# EasyEDA Pro project ProPrj_四轴3.0_2025-12-06.epro, schematic Schematic1
Board Name: main; Create Date: 2025-09-14; Page Name: P1; Project Name: 四轴3.0; Schematic Name: Schematic1; Update Date: 2025-09-14; Company: 嘉立创EDA; Page Size: A4; Version: V1.0
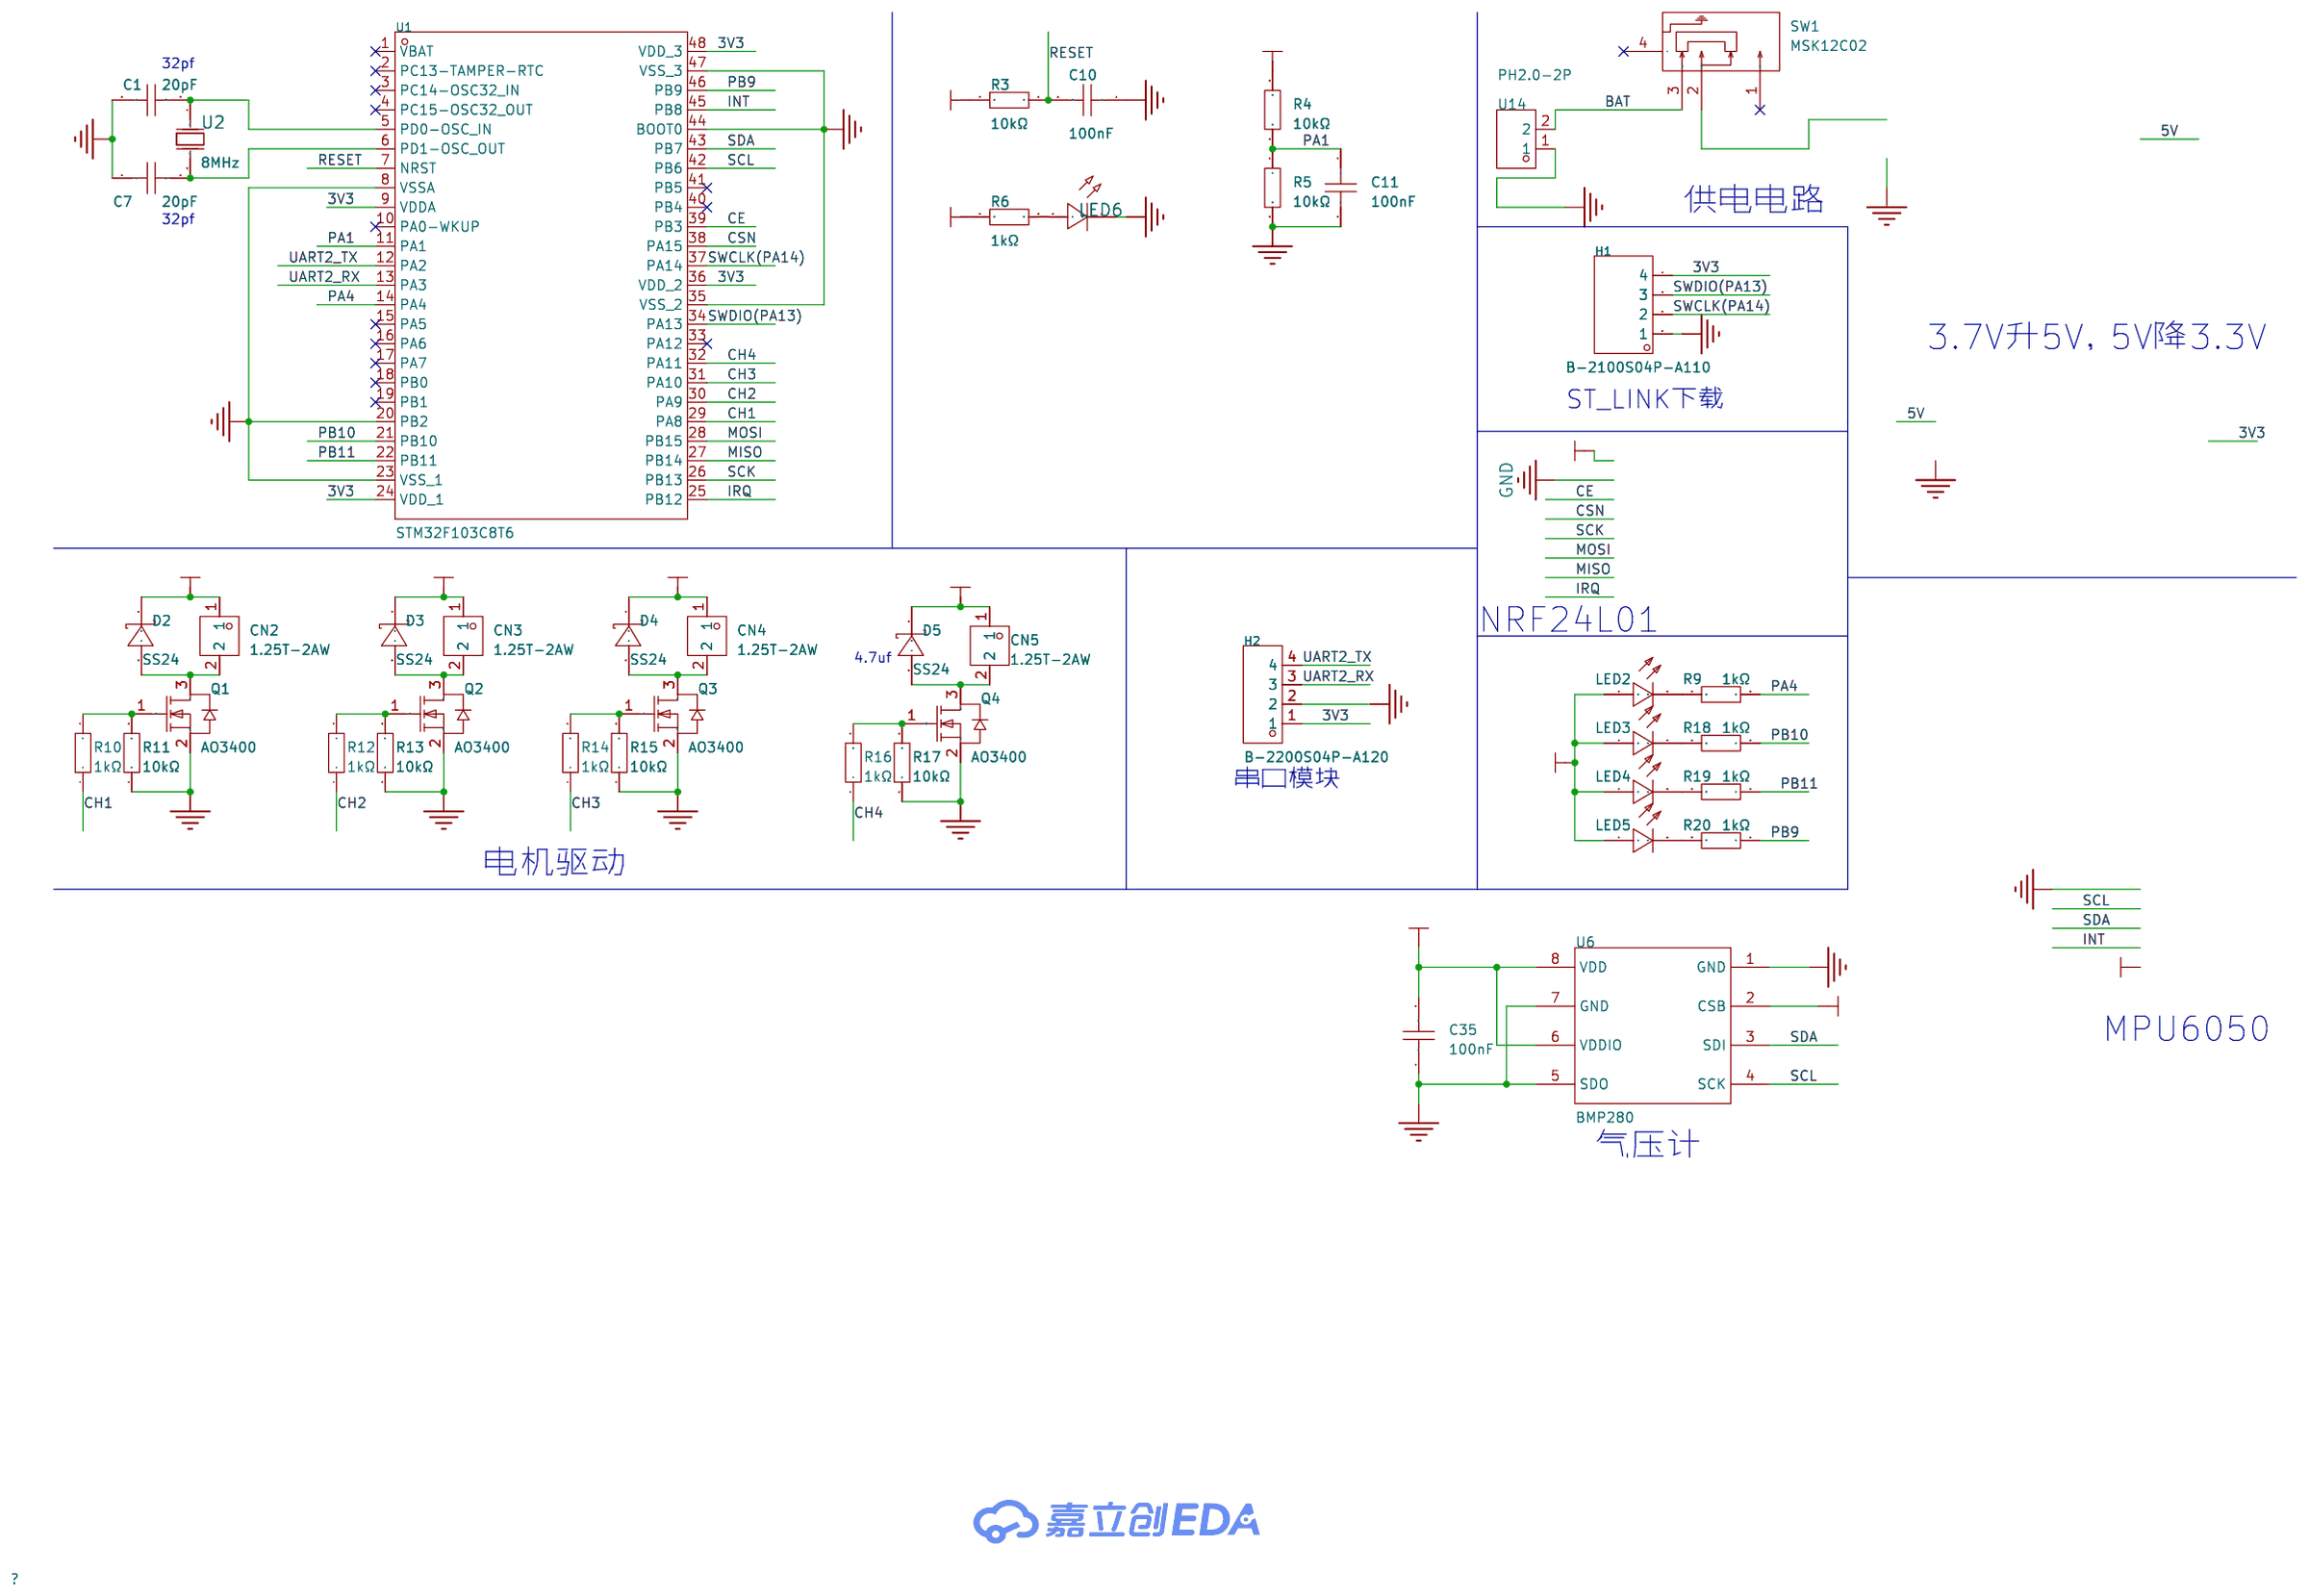
[diagram p4: schematic sheet]

## Parts
C1  20pF  [C0603]
C7  20pF  [C0603]
C10  100nF  [C0603]
C11  100nF  [C0603]
C35  100nF  [C0603]
CBB1  -
CBB2  -
CBB3  -
CBB4  -
CN2  1.25T-2AW  [CONN-TH_1.25T-2AW]
CN3  1.25T-2AW  [CONN-TH_1.25T-2AW]
CN4  1.25T-2AW  [CONN-TH_1.25T-2AW]
CN5  1.25T-2AW  [CONN-TH_1.25T-2AW]
D2  SS24  [SMA_L4.3-W2.6-LS5.2-RD]
D3  SS24  [SMA_L4.3-W2.6-LS5.2-RD]
D4  SS24  [SMA_L4.3-W2.6-LS5.2-RD]
D5  SS24  [SMA_L4.3-W2.6-LS5.2-RD]
H1  B-2100S04P-A110  [HDR-TH_4P-P2.54-V-M]
H2  B-2200S04P-A120  [HDR-TH_4P-P2.54-V-F]
LED2  204-10SURD/S530-A3-L  [LED-TH_BD3.0-P2.54-FD]
LED3  204-10SURD/S530-A3-L  [LED-TH_BD3.0-P2.54-FD]
LED4  204-10SURD/S530-A3-L  [LED-TH_BD3.0-P2.54-FD]
LED5  204-10SURD/S530-A3-L  [LED-TH_BD3.0-P2.54-FD]
LED6  -  [LED_0603]
Q1  AO3400  [SOT-23_L2.9-W1.3-P1.90-LS2.4-BR]
Q2  AO3400  [SOT-23_L2.9-W1.3-P1.90-LS2.4-BR]
Q3  AO3400  [SOT-23_L2.9-W1.3-P1.90-LS2.4-BR]
Q4  AO3400  [SOT-23_L2.9-W1.3-P1.90-LS2.4-BR]
R3  10kΩ  [R0603]
R4  10kΩ  [R0603]
R5  10kΩ  [R0603]
R6  1kΩ  [R0603]
R9  1kΩ  [R0603]
R10  1kΩ  [R0603]
R11  10kΩ  [R0603]
R12  1kΩ  [R0603]
R13  10kΩ  [R0603]
R14  1kΩ  [R0603]
R15  10kΩ  [R0603]
R16  1kΩ  [R0603]
R17  10kΩ  [R0603]
R18  1kΩ  [R0603]
R19  1kΩ  [R0603]
R20  1kΩ  [R0603]
SW1  MSK12C02  [SW-TH_MSK12C02]
U1  STM32F103C8T6  [LQFP-48_L7.0-W7.0-P0.50-LS9.0-BL]
U2  8MHz  [CRYSTAL-SMD_L11.5-W4.8-LS12.7]
U6  BMP280  [LGA-8_L2.5-W2.0-P0.65_AMP6127]
U14  PH2.0-2P  [CONN-TH_2P-P2.00_BOSSIE_BX-PH2.0-2PZZ]

## Library data of the parts
C1 C7 = CL10C200JB8NNNC: 容值:20pF;精度:±5%;额定电压:50V;温度系数:C0G;; LCSC Part Name: 20pF ±5% 50V; Supplier Part: C1648; Manufacturer: SAMSUNG(三星); Supplier Footprint: 0603; JLCPCB Part Class: Basic Part; Datasheet: https://item.szlcsc.com/datasheet/CL10C200JB8NNNC/2000.html; Supplier: LCSC; Tolerance: ±5%; Voltage Rating: 50V; Temperature Coefficient: C0G
C10 C11 C35 = CGA0603X7R104K500JT: 容值:100nF;精度:±10%;额定电压:50V;温度系数:X7R;; LCSC Part Name: 100nF ±10% 50V; Supplier Part: C6119867; Manufacturer: HRE(芯声); Supplier Footprint: 0603; JLCPCB Part Class: Extended Part; Datasheet: https://atta.szlcsc.com/upload/public/pdf/source/20250103/C44077DA9E7B3EFAE02F22B6D3D1CBC9.pdf; Supplier: LCSC; Tolerance: ±10%; Voltage Rating: 50V; Temperature Coefficient: X7R
CN2-CN5 = 1.25T-2AW: 参考系列:-;间距:1.25mm;插针结构:1x2P;排数:1;每排PIN数:2;行距:-;公母:公型插针;安装方式:弯插;额定电流:1A;工作温度范围:-25℃~+85℃;; LCSC Part Name: 1.25mm 1x2P 弯插; Supplier Part: C722634; Manufacturer: CAX(创都); Supplier Footprint: 插件,P=1.25mm; Datasheet: https://atta.szlcsc.com/upload/public/pdf/source/20200831/C722634_24F26787281092EEA77CD6D878338187.pdf; Supplier: LCSC; Pitch: 1.25mm; Pins Structure: 1x2P; Number of Rows: 1; Number of PINs Per Row: 2; Gender: 公型插针; Mounting Style: 弯插; Current Rating (Max): 1A; Operating Temperature Range: -25℃~+85℃
D2-D5 = SS24_C50645: 二极管配置:独立式;正向压降(Vf):550mV@2A;直流反向耐压(Vr):40V;整流电流:2A;; LCSC Part Name: 电压:40V 电流:2A; Supplier Part: C50645; Manufacturer: MDD(辰达半导体); Supplier Footprint: SMA(DO-214AC); Datasheet: https://atta.szlcsc.com/upload/public/pdf/source/20230314/0DB686FE9AB7A29C3C9F91DCAAB84FDC.pdf; Supplier: LCSC; Diode Configuration: 独立式; Forward Voltage (Vf@If): 550mV@2A; Reverse Voltage (Vr): 40V; Rectified Current: 2A; Reverse Leakage Current (Ir): 500uA@40V
H1 = B-2100S04P-A110: 排数:单排;总PIN位数:4P;间距:2.54mm;插针结构:1x4P;行距:-;安装类型:直插;圆针/方针:-;额定电流:-;额定电压:-;配合针长度:6mm;塑高:2.54mm;端接针长度:3mm;触头材质:黄铜;触头镀层:-;工作温度范围:-40℃~+105℃;颜色:黑色;; LCSC Part Name: 2.54mm 1x4P 直插; Supplier Part: C124378; Manufacturer: Ckmtw(灿科盟); Supplier Footprint: 插件,P=2.54mm; JLCPCB Part Class: Extended Part; Datasheet: https://atta.szlcsc.com/upload/public/pdf/source/20170821/C124381_1503303309126901535.pdf; Supplier: LCSC; Number of Rows: 单排; Number of Pins: 4P; Pitch: 2.54mm; Pin Structure: 1x4P; Mounting Type: 直插; Length of Mating Pin: 6mm; Insulation Height: 2.54mm; Length of End Connection Pin: 3mm; Contact Material: 黄铜; Operating Temperature Range: -40℃~+105℃; Color: 黑色
H2 = B-2200S04P-A120: 排数:单排;总孔位数:4;间距:2.54mm;插孔结构:1x4P;行距:-;安装类型:直插;塑高:-;触头材质:黄铜;触头镀层:-;; LCSC Part Name: 2.54mm 1x4P; Supplier Part: C124413; Manufacturer: Ckmtw(灿科盟); Supplier Footprint: 直插,P=2.54mm; JLCPCB Part Class: Extended Part; Supplier: LCSC; Number of Rows: 单排; Number of Holes: 4; Pitch: 2.54mm; Holes Structure: 1x4P; Mounting Type: 直插; Contact Material: 黄铜
LED2-LED5 = 204-10SURD/S530-A3-L: 灯头类型:3mm圆形灯头;发光颜色:红色;功率:60mW;正向电流:20mA;主波长:624nm;二极管配置:-;透镜颜色:雾状红透镜;色温:-;发光角度:40°;载带方式:-;工作温度:-40℃~+85℃;; LCSC Part Name: 红灯; Supplier Part: C99771; Manufacturer: EVERLIGHT(亿光); Supplier Footprint: 插件,D=3mm; Datasheet: https://atta.szlcsc.com/upload/public/pdf/source/20170504/1493866972127.pdf; Supplier: LCSC; Lamp Holder Type: 3mm圆形灯头; Emitted Color: 红色; Power Dissipation: 60mW; Forward Current: 20mA; Dominant Wavelength: 624nm; Peak Wavelength: 632nm; Lens Color: 雾状红透镜; Viewing Angle: 40°; Operating Temperature: -40℃~+85℃
LED6 = LED_0603-R: Supplier Footprint: 0603
Q1-Q4 = AO3400_C2938367: 类型:1个N沟道;漏源电压(Vdss):30V;连续漏极电流(Id):5.8A;功率(Pd):1.5W;导通电阻(RDS(on)@Vgs,Id):35mΩ@10V,5.8A;阈值电压(Vgs(th)@Id):1.2V@250uA;; LCSC Part Name: 1个N沟道 耐压:30V 电流:5.8A; Supplier Part: C2938367; Manufacturer: GOODWORK(固得沃克); Supplier Footprint: SOT-23; Datasheet: https://atta.szlcsc.com/upload/public/pdf/source/20211229/1DE691E24B5B31BB262C463D0489A9AB.pdf; Supplier: LCSC; Type: 1个N沟道; Drain Source Voltage (Vdss): 30V; Continuous Drain Current (Id): 5.8A; Power Dissipation (Pd): 1.5W; Drain Source On Resistance (RDS(on)@Vgs,Id): 35mΩ@10V,5.8A; Gate Threshold Voltage (Vgs(th)@Id): 1.2V@250uA; Input Capacitance (Ciss@Vds): 1.05nF@15V; Reverse Transfer Capacitance (Crss@Vds): 77pF@15V
R3-R6 R11 R13 R15 R17 = 0603WAF1002T5E: 电阻类型:厚膜电阻;阻值:10kΩ;精度:±1%;功率:100mW;工作电压:75V;温度系数:±100ppm/℃;; LCSC Part Name: 厚膜电阻 10kΩ ±1% 100mW; Supplier Part: C25804; Manufacturer: UNI-ROYAL(厚声); Supplier Footprint: 0603; JLCPCB Part Class: Basic Part; Datasheet: https://item.szlcsc.com/datasheet/0603WAF1002T5E/26547.html; Supplier: LCSC; Type: 厚膜电阻; Tolerance: ±1%; Power(Watts): 100mW; Voltage-Supply(Max): 75V; Temperature Coefficient: ±100ppm/℃; Operating Temperature: -55℃~+155℃
R9 R10 R12 R14 R16 R18-R20 = 0603WAF1001T5E: 电阻类型:厚膜电阻;阻值:1kΩ;精度:±1%;功率:100mW;最大工作电压:75V;温度系数:±100ppm/℃;; LCSC Part Name: 1kΩ ±1% 100mW 厚膜电阻; Supplier Part: C21190; Manufacturer: UNI-ROYAL(厚声); Supplier Footprint: 0603; JLCPCB Part Class: Basic Part; Datasheet: https://atta.szlcsc.com/upload/public/pdf/source/20200306/C422600_1E6D84923E4A46A82E41ADD87F860B5C.pdf; Supplier: LCSC; Type: 厚膜电阻; Tolerance: ±1%; Power(Watts): 100mW; Overload Voltage (Max): 75V; Temperature Coefficient: ±100ppm/℃; Operating Temperature Range: -55℃~+155℃
SW1 = MSK12C02: 电路结构:单刀双掷;安装方式:卧贴;开关颜色:-;额定电流(DC):50mA;额定电压(DC):12V;额定电流(AC):-;额定电压(AC):-;机械寿命:1万次;; LCSC Part Name: 两档侧拨贴片 7脚 滑动开关; Supplier Part: C431540; Manufacturer: SHOU HAN(首韩); Supplier Footprint: SMD; Datasheet: https://atta.szlcsc.com/upload/public/pdf/source/20190925/C431540_89155AEF0758B9AD1B2D805F83FB12E3.pdf; Supplier: LCSC; Circuit: 单刀双掷; Pin Style: SMD接片; Switch Length: 8mm; Switch Width: 2.8mm; Switch Height: 1.4mm; Mounting Style: 卧贴; Current Rating (DC): 50mA; Voltage Rating (DC): 12V; Mechanical Life: 1万次; Operating Temperature: -20℃~+70℃
U1 = STM32F103C8T6: CPU内核:ARM Cortex-M3;CPU最大主频:72MHz;工作电压范围:2V~3.6V;内部振荡器:有;程序 FLASH容量:64K@x8bit;RAM总容量:20KB;EEPROM/数据 FLASH容量:-;GPIO端口数量:37;ADC(单元数/通道数/位数):1@x10ch/12bit;外设/功能/协议栈:看门狗；DMA；看门狗；片载温度传感器;工作温度范围:-40℃~+85℃;; LCSC Part Name: ARM Cortex-M3 72MHz 闪存：64K@x8bit RAM：20KB MSL=3; Supplier Part: C8734; Manufacturer: ST(意法半导体); Supplier Footprint: LQFP-48(7x7); Supplier: LCSC; CPU Core: ARM Cortex-M3; Maximum Frequency: 72MHz; Supply Voltage Range: 2V~3.6V; Internal Oscillator: 有; Program FLASH Size: 64K@x8bit; RAM Size: 20KB; GPIO Ports Number: 37; ADC (Units/Channels/bits): 1@x10ch/12bit; Peripherals / Functions / Protocol Stacks: 看门狗；DMA；看门狗；片载温度传感器; Operating Temperature Range: -40℃~+85℃
U2 = X49SM8MSD2SC: 晶振类型:贴片晶振;频率:8MHz;常温频差:±20ppm;负载电容:20pF;频率稳定度:±30ppm;; LCSC Part Name: HC-49SMD 8MHZ 2P 49SMD 20PF ±20PPM -20~70℃（±30PPM）; Supplier Part: C12674; Manufacturer: YXC(扬兴晶振); Supplier Footprint: HC-49S-SMD; JLCPCB Part Class: Basic Part; Datasheet: https://atta.szlcsc.com/upload/public/pdf/source/20240329/3EBF42EBCAB50CA65B6FA9D7CFA1955A.pdf; Supplier: LCSC; Type: 贴片晶振; Normal temperature Frequency Tolerance: ±20ppm; Load Capacitance: 20pF; Frequency Stability: ±30ppm; Operating Temperature: -20℃~+70℃
U6 = BMP280: Bosch气压传感器新品，可测量大气压力，带高精度温度测量，可校准精确计算海拔高度。I2C或SPI接口，宽量程（300-1100hpa），精度高; LCSC Part Name: BMP280 停产; Supplier Part: C83291; Manufacturer: Bosch(博世); Supplier Footprint: LGA-8(2x2.5); JLCPCB Part Class: 扩展库; Datasheet: https://atta.szlcsc.com/upload/public/pdf/source/20200702/C83291_F39E84AB7DFC569A4C7554F8659640A1.pdf; Supplier: LCSC
U14 = PH2.0-2P: Supplier Part: C9900095162; JLCPCB Part Class: 扩展库; Supplier: LCSC

## Nets
3V3: C1.1 C7.1 C10.1 C11.2 C35.1 C35.2 CBB1.(IRQ) CBB2.(3V3) CBB3.(GND) CBB4.(GND) H1.1 H1.4 H2.1 H2.2 LED2.1(A) LED3.1(A) LED4.1(A) LED5.1(A) LED6.1(C) Q1.2(S) Q2.2(S) Q3.2(S) Q4.2(S) R3.2 R5.2 R6.2 R11.1 R13.1 R15.1 R17.1 SW1.2 U1.8(VSSA) U1.9(VDDA) U1.20(PB2) U1.23(VSS_1) U1.24(VDD_1) U1.25(PB12) U1.26(PB13) U1.27(PB14) U1.28(PB15) U1.35(VSS_2) U1.36(VDD_2) U1.38(PA15) U1.39(PB3) U1.42(PB6) U1.43(PB7) U1.44(BOOT0) U1.45(PB8) U1.47(VSS_3) U1.48(VDD_3) U6.1(GND) U6.2(CSB) U6.3(SDI) U6.4(SCK) U6.5(SDO) U6.6(VDDIO) U6.7(GND) U6.8(VDD) U14.1
BAT: CN2.1 CN3.1 CN4.1 CN5.1 D2.1(K) D3.1(K) D4.1(K) D5.1(K) R4.1 SW1.3 U14.2
CH1: R10.1 U1.29(PA8)
CH2: R12.1 U1.30(PA9)
CH3: R14.1 U1.31(PA10)
CH4: R16.1 U1.32(PA11)
PA1: C11.1 R4.2 R5.1 U1.11(PA1)
PA4: R9.1 U1.14(PA4)
PB9: R20.1 U1.46(PB9)
PB10: R18.1 U1.21(PB10)
PB11: R19.1 U1.22(PB11)
RESET: C10.2 R3.1 U1.7(NRST)
SWCLK(PA14): H1.2 U1.37(PA14)
SWDIO(PA13): H1.3 U1.34(PA13)
UART2_RX: H2.3 U1.13(PA3)
UART2_TX: H2.4 U1.12(PA2)
$1N5880: Q3.1(G) R14.2 R15.2
$1N5885: Q2.1(G) R12.2 R13.2
$1N5890: Q1.1(G) R10.2 R11.2
$1N5900: LED6.2(A) R6.1
$1N5903: C7.2 U1.6(PD1-OSC_OUT) U2.2(OSC2)
$1N5904: C1.2 U1.5(PD0-OSC_IN) U2.1(OSC1)
$1N5960: CN2.2 D2.2(A) Q1.3(D)
$1N5961: CN4.2 D4.2(A) Q3.3(D)
$1N5962: CN3.2 D3.2(A) Q2.3(D)
$1N5973: LED2.2(K) R9.2
$1N5974: LED3.2(K) R18.2
$1N5975: LED4.2(K) R19.2
$1N5976: LED5.2(K) R20.2
$1N6034: CN5.2 D5.2(A) Q4.3(D)
$1N6037: Q4.1(G) R16.2 R17.2

Not connected (* = marked no-connect by the designer): SW1 1* 4*; U1 1(VBAT)* 2(PC13-TAMPER-RTC)* 3(PC14-OSC32_IN)* 4(PC15-OSC32_OUT)* 10(PA0-WKUP)* 15(PA5)* 16(PA6)* 17(PA7)* 18(PB0)* 19(PB1)* 33(PA12)* 40(PB4)* 41(PB5)*

## Notes on the sheet
- 32pf
- 32pf
- 供电电路
- 3.7V升5V，5V降3.3V
- ST_LINK下载
- NRF24L01
- 4.7uf
- 串口模块
- 电机驱动
- MPU6050
- 气压计
